# Altium project ISO_DP_MCP4651_Project.PrjPCB
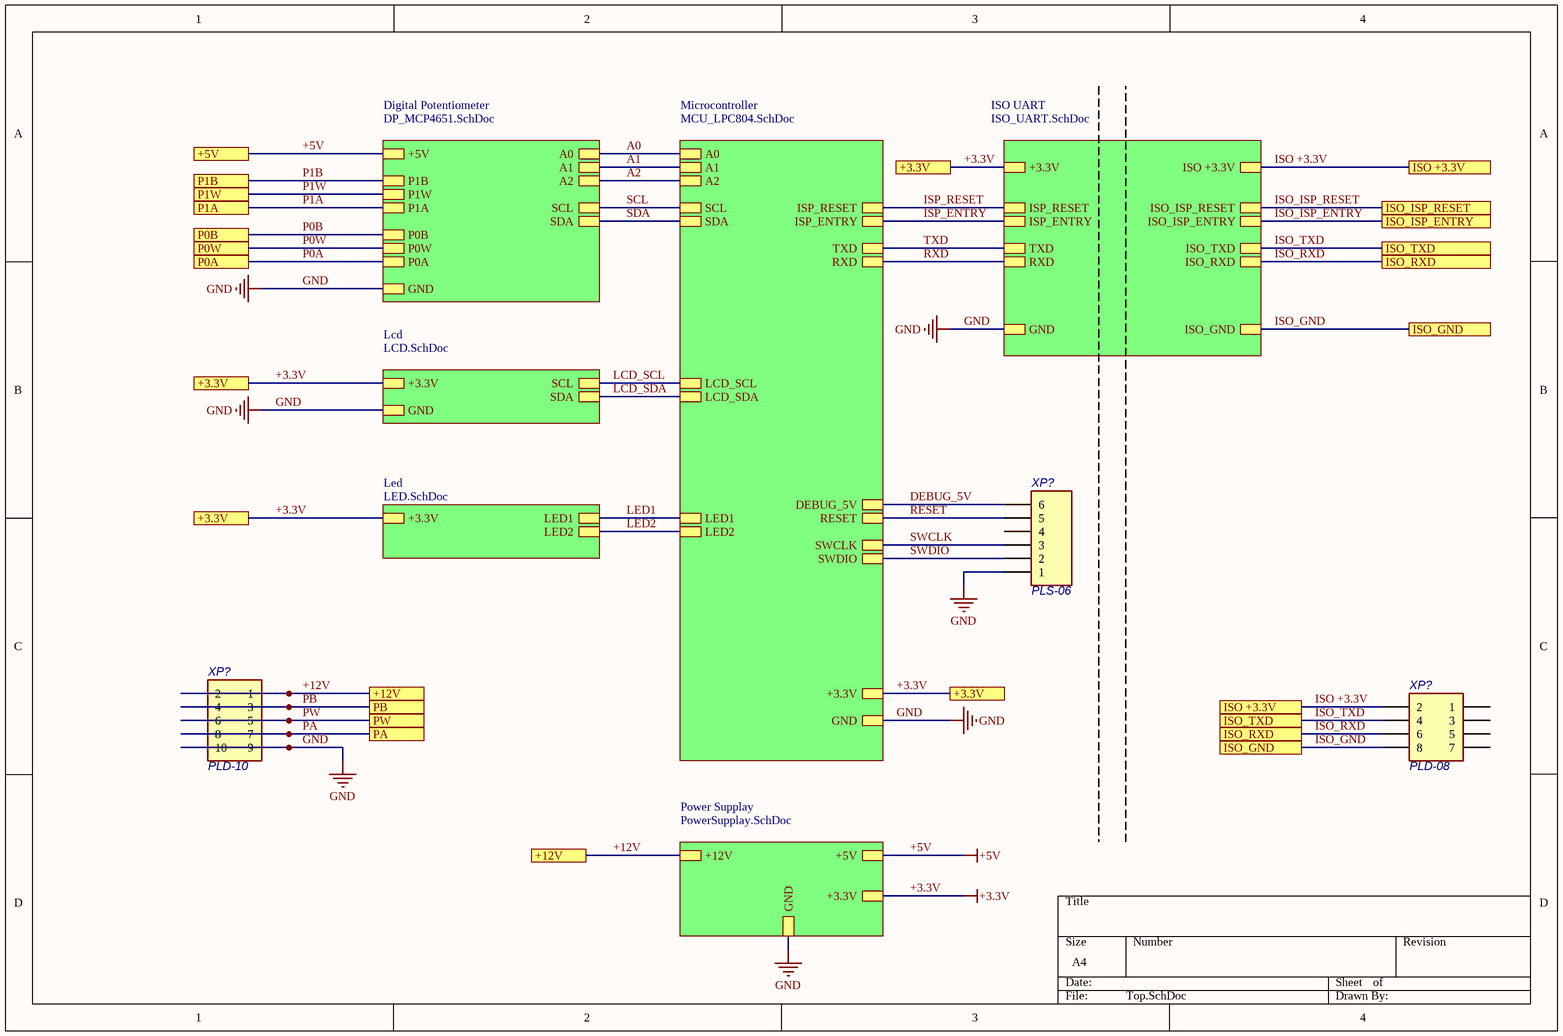
[diagram p0: Top.SchDoc]
7 sheets, 51 parts. Net scope: hierarchical (ports join the sheet entries above them; power ports are global).
Sheets:
  Top.SchDoc
    Digital Potentiometer = DP_MCP4651.SchDoc
    Microcontroller = MCU_LPC804.SchDoc
    Power Supplay = PowerSupplay.SchDoc
    ISO UART = ISO_UART.SchDoc
    Led = LED.SchDoc
    Lcd = LCD.SchDoc

## Sheet Top.SchDoc
size A4

### Parts
(Parts that share a designator on the sheet are numbered #1, #2 ... from top to bottom, then left to right.)
XP?#1  PLS-06  [PLS-06]
XP?#2  PLD-10  [PLD-10]
XP?#3  PLD-08  [PLD-08]

### Sub-sheets
Digital Potentiometer = DP_MCP4651.SchDoc: SCL, SDA, +5V, A0, A1, A2, P1B, P1W, P1A, P0B, P0A, P0W, GND
ISO UART = ISO_UART.SchDoc: ISP_RESET, ISP_ENTRY, ISO_ISP_RESET, ISO_ISP_ENTRY, +3.3V, ISO +3.3V, GND, ISO_GND, ISO_TXD, ISO_RXD, TXD, RXD
Lcd = LCD.SchDoc: GND, +3.3V, SCL, SDA
Led = LED.SchDoc: +3.3V, LED1, LED2
Microcontroller = MCU_LPC804.SchDoc: SCL, SDA, ISP_RESET, ISP_ENTRY, A0, A1, A2, LCD_SCL, LCD_SDA, DEBUG_5V, RESET, SWCLK, SWDIO, LED1, LED2, +3.3V, GND, TXD, RXD
Power Supplay = PowerSupplay.SchDoc: +3.3V, GND, +12V, +5V

### Ports
+3.3V, +5V, +12V, ISO +3.3V, ISO_GND, ISO_ISP_ENTRY, ISO_ISP_RESET, ISO_RXD, ISO_TXD, P0A, P0B, P0W, P1A, P1B, P1W, PA, PB, PW

### Nets
+3.3V: port +3.3V, sheet Microcontroller/+3.3V, sheet Power Supplay/+3.3V, sheet ISO UART/+3.3V, sheet Led/+3.3V, sheet Lcd/+3.3V
+5V: port +5V, sheet Digital Potentiometer/+5V, sheet Power Supplay/+5V
GND: XP?#1.1 XP?#2.9 XP?#2.10 ; sheet Digital Potentiometer/GND, sheet Microcontroller/GND, sheet Power Supplay/GND, sheet ISO UART/GND, sheet Lcd/GND
+12V: XP?#2.1 XP?#2.2 ; port +12V, sheet Power Supplay/+12V
A0: sheet Digital Potentiometer/A0, sheet Microcontroller/A0
A1: sheet Digital Potentiometer/A1, sheet Microcontroller/A1
A2: sheet Digital Potentiometer/A2, sheet Microcontroller/A2
DEBUG_5V: XP?#1.6 ; sheet Microcontroller/DEBUG_5V
ISO +3.3V: XP?#3.2 ; port ISO +3.3V, sheet ISO UART/ISO +3.3V
ISO_GND: XP?#3.8 ; port ISO_GND, sheet ISO UART/ISO_GND
ISO_ISP_ENTRY: port ISO_ISP_ENTRY, sheet ISO UART/ISO_ISP_ENTRY
ISO_ISP_RESET: port ISO_ISP_RESET, sheet ISO UART/ISO_ISP_RESET
ISO_RXD: XP?#3.6 ; port ISO_RXD, sheet ISO UART/ISO_RXD
ISO_TXD: XP?#3.4 ; port ISO_TXD, sheet ISO UART/ISO_TXD
ISP_ENTRY: sheet Microcontroller/ISP_ENTRY, sheet ISO UART/ISP_ENTRY
ISP_RESET: sheet Microcontroller/ISP_RESET, sheet ISO UART/ISP_RESET
LCD_SCL: sheet Microcontroller/LCD_SCL, sheet Lcd/SCL
LCD_SDA: sheet Microcontroller/LCD_SDA, sheet Lcd/SDA
LED1: sheet Microcontroller/LED1, sheet Led/LED1
LED2: sheet Microcontroller/LED2, sheet Led/LED2
P0A: port P0A, sheet Digital Potentiometer/P0A
P0B: port P0B, sheet Digital Potentiometer/P0B
P0W: port P0W, sheet Digital Potentiometer/P0W
P1A: port P1A, sheet Digital Potentiometer/P1A
P1B: port P1B, sheet Digital Potentiometer/P1B
P1W: port P1W, sheet Digital Potentiometer/P1W
PA: XP?#2.7 XP?#2.8 ; port PA
PB: XP?#2.3 XP?#2.4 ; port PB
PW: XP?#2.5 XP?#2.6 ; port PW
RESET: XP?#1.5 ; sheet Microcontroller/RESET
RXD: sheet Microcontroller/RXD, sheet ISO UART/RXD
SCL: sheet Digital Potentiometer/SCL, sheet Microcontroller/SCL
SDA: sheet Digital Potentiometer/SDA, sheet Microcontroller/SDA
SWCLK: XP?#1.3 ; sheet Microcontroller/SWCLK
SWDIO: XP?#1.2 ; sheet Microcontroller/SWDIO
TXD: sheet Microcontroller/TXD, sheet ISO UART/TXD

Not connected (* = marked no-connect by the designer): XP?#1 4; XP?#3 1 3 5 7

### Library data of the parts
XP?#1 = PLS-06: Однорядный прямой штыревой соединитель; Manufacturer: BrownBear; SpecificationName: Connector; Ведомость покупных: Y; Author: Gr.; Part Number: PLS-06; DateModification: 24.03.2011; ManufacturerPartNumber: PLS-06; Value: *; Tolerance: *; Power\Voltage: *; TKE: *; Корпус: *; TU/GOST: *; Примечание: *; Rem: *; ComponentLink1Description: Parametrs; ComponentLink2Description: Site; ComponentLink2URL: http://www.brownbear.ru/; Component Type: Standard; Component Kind: Standard
XP?#2 = PLD-10: Двухрядный прямой штыревой соединитель; Manufacturer: BrownBear; SpecificationName: Connector; Ведомость покупных: Y; Author: Gr.; Part Number: PLD-10; DateModification: 24.03.2011; ManufacturerPartNumber: PLD-10; Value: *; Tolerance: *; Power\Voltage: *; TKE: *; Корпус: *; TU/GOST: *; Примечание: *; Rem: *; ComponentLink1Description: Parametrs; ComponentLink2Description: Site; ComponentLink2URL: http://www.brownbear.ru/; Component Type: Standard; Component Kind: Standard
XP?#3 = PLD-08: Двухрядный прямой штыревой соединитель; Manufacturer: BrownBear; SpecificationName: Connector; Ведомость покупных: Y; Author: Gr.; Part Number: PLD-08; DateModification: 24.03.2011; ManufacturerPartNumber: PLD-08; Value: *; Tolerance: *; Power\Voltage: *; TKE: *; Корпус: *; TU/GOST: *; Примечание: *; Rem: *; ComponentLink1Description: Parametrs; ComponentLink2Description: Site; ComponentLink2URL: http://www.brownbear.ru/; Component Type: Standard; Component Kind: Standard

## Sheet DP_MCP4651.SchDoc
size A4
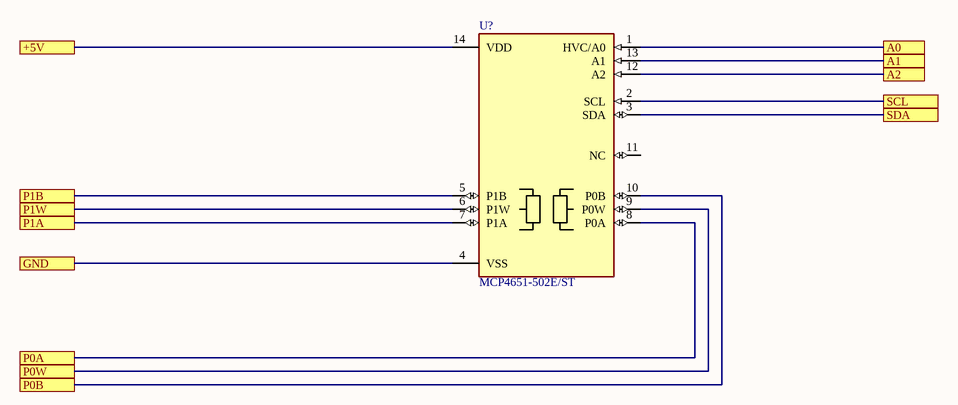
[diagram p1: DP_MCP4651.SchDoc]

### Parts
(Parts that share a designator on the sheet are numbered #1, #2 ... from top to bottom, then left to right.)
U?#1  MCP4651-502E/ST  [TSSOP-14]

### Ports
+5V, A0, A1, A2, GND, P0A, P0B, P0W, P1A, P1B, P1W, SCL, SDA

### Nets
+5V: U?#1.14(VDD) ; port +5V
GND: U?#1.4(VSS) ; port GND
A0: U?#1.1(HVC/A0) ; port A0
A1: U?#1.13(A1) ; port A1
A2: U?#1.12(A2) ; port A2
P0A: U?#1.8(P0A) ; port P0A
P0B: U?#1.10(P0B) ; port P0B
P0W: U?#1.9(P0W) ; port P0W
P1A: U?#1.7(P1A) ; port P1A
P1B: U?#1.5(P1B) ; port P1B
P1W: U?#1.6(P1W) ; port P1W
SCL: U?#1.2(SCL) ; port SCL
SDA: U?#1.3(SDA) ; port SDA

Not connected (* = marked no-connect by the designer): U?#1 11(NC)

### Library data of the parts
U?#1 = MCP4651: Digital Potentiometr; Manufacturer: Microchip; SpecificationName: IC; Package: None; Price: None; Value: *; MP: MCP4651-502E/ST; Availability: Unavailable; Part Number: MCP4651; Author: Sun; DateModification: 14.02.2022; ManufacturerPartNumber: MCP4651; Корпус: TSSOP-14

## Sheet MCU_LPC804.SchDoc
size A4
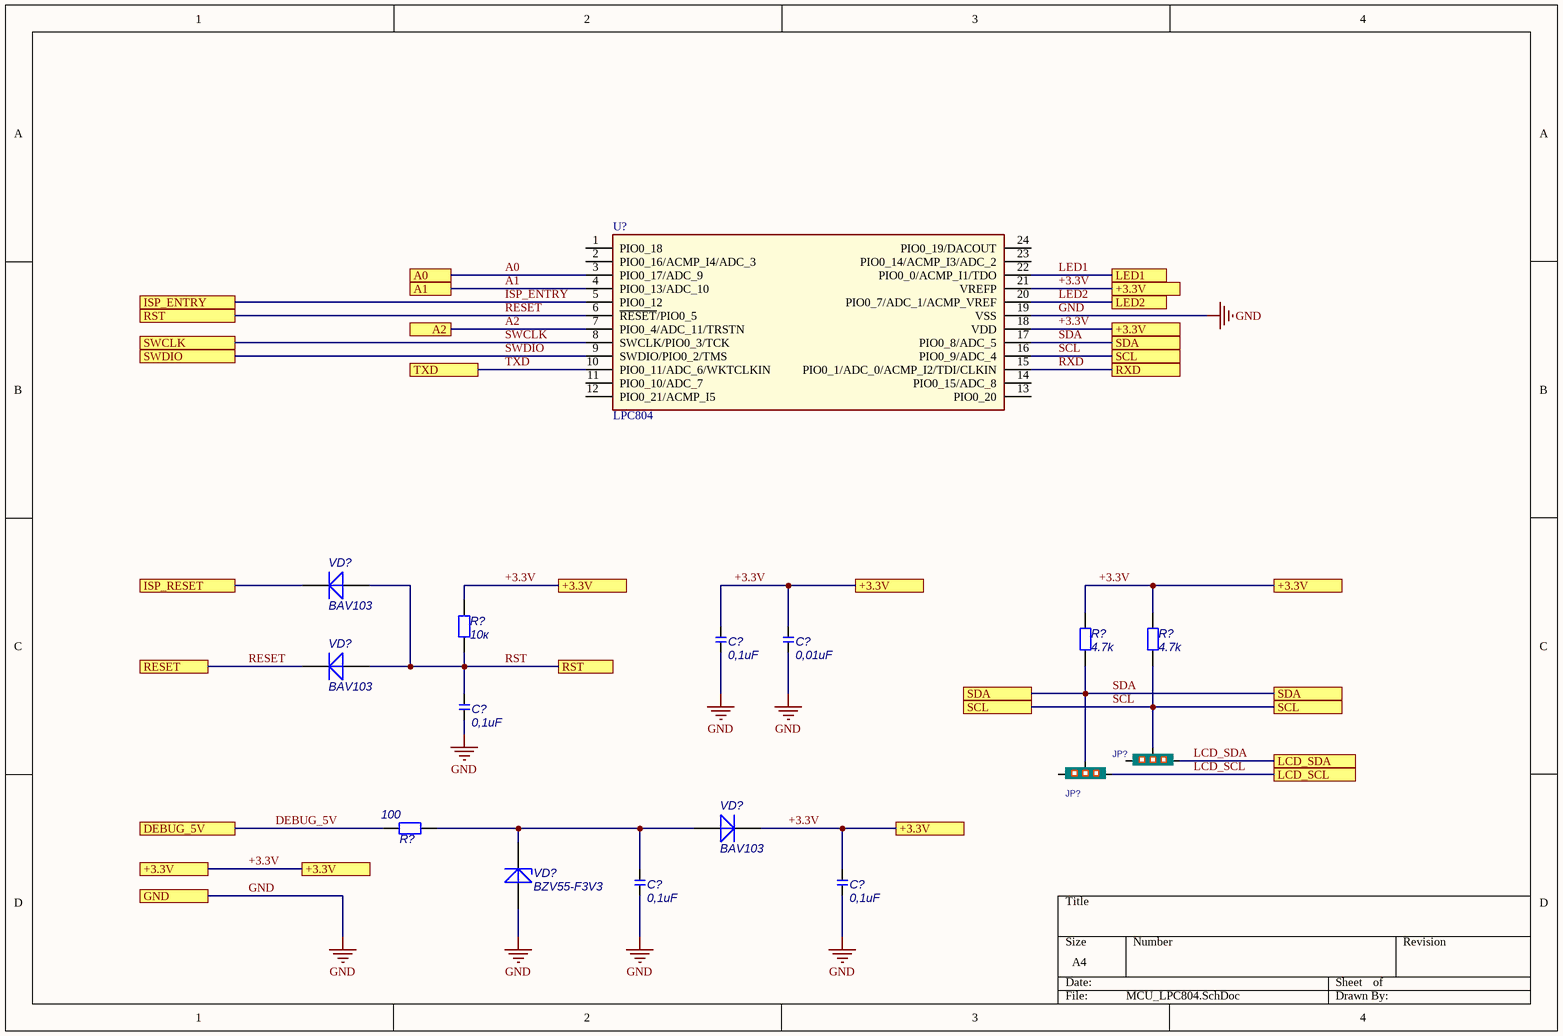
[diagram p2: MCU_LPC804.SchDoc]

### Parts
(Parts that share a designator on the sheet are numbered #1, #2 ... from top to bottom, then left to right.)
C?#1  0,1uF  [SMD1206-v1]
C?#2  0,01uF  [SMD1206-v1]
C?#3  0,1uF  [SMD1206-v1]
C?#4  0,1uF  [SMD1206-v1]
C?#5  0,1uF  [SMD1206-v1]
JP?#1  JP3_1  [Jumper_3]  (value not drawn)
JP?#2  JP3_1  [Jumper_3]  (value not drawn)
R?#1  4.7k  [SMD1206-v1]
R?#2  4.7k  [SMD1206-v1]
R?#3  10к  [SMD1206-v1]
R?#4  100  [SMD1206-v1]
U?#2  LPC804  [TSSOP-24_1]
VD?#1  BAV103  [SOD80C_V1]
VD?#2  BAV103  [SOD80C_V1]
VD?#3  BAV103  [SOD80C_V1]
VD?#4  BZV55-F3V3  [SOD80C_V1]

### Ports
+3.3V, A0, A1, A2, DEBUG_5V, GND, ISP_ENTRY, ISP_RESET, LCD_SCL, LCD_SDA, LED1, LED2, RESET, RST, RXD, SCL, SDA, SWCLK, SWDIO, TXD

### Nets
+3.3V: C?#1.2 C?#2.2 C?#5.2 R?#1.2 R?#2.2 R?#3.1 U?#2.18(VDD) U?#2.21(VREFP) VD?#3.2(K) ; port +3.3V
GND: C?#1.1 C?#2.1 C?#3.1 C?#4.1 C?#5.1 U?#2.19(VSS) VD?#4.1(A) ; port GND
A0: U?#2.3(PIO0_17/ADC_9) ; port A0
A1: U?#2.4(PIO0_13/ADC_10) ; port A1
A2: U?#2.7(PIO0_4/ADC_11/TRSTN) ; port A2
DEBUG_5V: R?#4.2 ; port DEBUG_5V
ISP_ENTRY: U?#2.5(PIO0_12) ; port ISP_ENTRY
ISP_RESET: VD?#1.2(K) ; port ISP_RESET
LCD_SCL: JP?#2.1 ; port LCD_SCL
LCD_SDA: JP?#1.1 ; port LCD_SDA
LED1: U?#2.22(PIO0_0/ACMP_I1/TDO) ; port LED1
LED2: U?#2.20(PIO0_7/ADC_1/ACMP_VREF) ; port LED2
RESET: C?#3.2 R?#3.2 U?#2.6(~{RESET}/PIO0_5) VD?#1.1(A) VD?#2.1(A) VD?#2.2(K) ; port RST, port RESET  [also labelled RST]
RXD: U?#2.15(PIO0_1/ADC_0/ACMP_I2/TDI/CLKIN) ; port RXD
SCL: JP?#1.2 R?#2.1 U?#2.16(PIO0_9/ADC_4) ; port SCL
SDA: JP?#2.2 R?#1.1 U?#2.17(PIO0_8/ADC_5) ; port SDA
SWCLK: U?#2.8(SWCLK/PIO0_3/TCK) ; port SWCLK
SWDIO: U?#2.9(SWDIO/PIO0_2/TMS) ; port SWDIO
TXD: U?#2.10(PIO0_11/ADC_6/WKTCLKIN) ; port TXD
NetC?#4_2: C?#4.2 R?#4.1 VD?#3.1(A) VD?#4.2(K)

Not connected (* = marked no-connect by the designer): JP?#1 3; JP?#2 3; U?#2 1(PIO0_18) 2(PIO0_16/ACMP_I4/ADC_3) 11(PIO0_10/ADC_7) 12(PIO0_21/ACMP_I5) 13(PIO0_20) 14(PIO0_15/ADC_8) 23(PIO0_14/ACMP_I3/ADC_2) 24(PIO0_19/DACOUT)

### Library data of the parts
C?#1 C?#3-C?#5 = SMD1206-0.1uF-50V: Конденсатор неполярный; Manufacturer: AVX; Power\Voltage: 50V; Ведомость покупных: Y; Author: Sun; Part Number: SMD1206-0.1uF-50V; DateModification: 11.10.2016; ManufacturerPartNumber: *; Value: 0,1uF; Tolerance: *; TKE: *; Корпус: SMD1206; TU/GOST: *; Примечание: *; Rem: *; SpecificationName: Конденсатор; ComponentLink1Description: Параметры; ComponentLink1URL: *; ComponentLink2Description: Сайт производителя; ComponentLink2URL: http://www.avx.com/; Component Type: Standard; Component Kind: Standard
C?#2 = SMD1206-0.01uF-50V: Конденсатор неполярный; Manufacturer: AVX; Power\Voltage: 50V; Ведомость покупных: Y; Author: Sun; Part Number: SMD1206-0.01uF-50V; DateModification: 11.10.2016; ManufacturerPartNumber: *; Value: 0,01uF; Tolerance: *; TKE: *; Корпус: SMD1206; TU/GOST: *; Примечание: *; Rem: *; SpecificationName: Конденсатор; ComponentLink1Description: Параметры; ComponentLink1URL: *; ComponentLink2Description: Сайт производителя; ComponentLink2URL: http://www.avx.com/; Component Type: Standard; Component Kind: Standard
JP?#1 JP?#2 = Jumper_3_a_pin: Part Field 1: 17-Jul-2002; Part Field 2: Re-released for DXP Platform.; Part Field 3: Altium Limited; Part Number: Jumper_3_a_pin
R?#1 R?#2 = SMD1206-4.7k-1%: Резистор постоянный; Manufacturer: Rohm Semiconductor; Tolerance: 1%; Ведомость покупных: Y; Author: Sun; Part Number: SMD1206-4.7k-1%; DateModication: 12.10.2016; ManufacturerPartNumber: *; Value: 4.7k; Power\Voltage: *; TKE: *; Корпус: SMD1206; TU/GOST: *; Примечание: *; Rem: *; SpecificationName: Резистор; ComponentLink1Description: Параметры; ComponentLink1URL: *; ComponentLink2Description: Сайт производителя; ComponentLink2URL: http://www.royalohm.com/; Component Type: Standard; Component Kind: Standard
R?#3 = SMD1206-10k-1%: Резистор постоянный; Manufacturer: Rohm Semiconductor; Tolerance: 1%; Ведомость покупных: Y; Author: Sun; Part Number: SMD1206-10k-1%; DateModication: 12.10.2016; ManufacturerPartNumber: *; Value: 10к; Power\Voltage: *; TKE: *; Корпус: SMD1206; TU/GOST: *; Примечание: *; Rem: *; SpecificationName: Резистор; ComponentLink1Description: Параметры; ComponentLink1URL: *; ComponentLink2Description: Сайт производителя; ComponentLink2URL: http://www.royalohm.com/; Component Type: Standard; Component Kind: Standard
R?#4 = SMD1206-100-1%: Резистор постоянный; Manufacturer: Rohm Semiconductor; Tolerance: 1%; Ведомость покупных: Y; Author: Sun; Part Number: SMD1206-100-1%; DateModication: 12.10.2016; ManufacturerPartNumber: *; Value: 100; Power\Voltage: *; TKE: *; Корпус: SMD1206; TU/GOST: *; Примечание: *; Rem: *; SpecificationName: Резистор; ComponentLink1Description: Параметры; ComponentLink1URL: *; ComponentLink2Description: Сайт производителя; ComponentLink2URL: http://www.royalohm.com/; Component Type: Standard; Component Kind: Standard
U?#2 = LPC804-TSSOP24: Microcontroller; Manufacturer: NXP; SpecificationName: IC; Bills of materials: Y; Part Number: LPC804-TSSOP24; Author: Sun; DateModification: 21.12.2020; ManufacturerPartNumber: LPC804; Value: *; Tolerance: *; Power\Voltage: *; TKE: *; Package: TSSOP-24; TU/GOST: *; Note: *; Rem: *; ComponentLink1Description: Site; ComponentLink1URL: http://www.nxp.com/; ComponentLink2Description: Parameters; Component Type: Standart; Component Kind: Standart
VD?#1-VD?#3 = BAV103: Диод; Manufacturer: NXP; Корпус: SOD80C; SpecificationName: Diod; Ведомость покупных: Y; Author: Gr.; Part Number: BAV103; DateModification: 23.02.2011; ManufacturerPartNumber: BAV103; Value: *; Tolerance: *; Power\Voltage: *; TKE: *; TU/GOST: *; Примечание: *; Rem: *; ComponentLink1Description: Parametrs; ComponentLink2Description: Сайт производителя; ComponentLink2URL: http://www.nxp.com/; Component Type: Standard; Component Kind: Standard
VD?#4 = BZV55-F3V3: Стабилитрон; Manufacturer: NXP; Tolerance: 3%; Корпус: SOD80C; Ведомость покупных: Y; Author: Gr.; Part Number: BZV55-F3V3; DateModification: 28.02.2011; ManufacturerPartNumber: BZV55-F3V3; Value: *; Power\Voltage: *; TKE: *; TU/GOST: *; Примечание: *; Rem: *; SpecificationName: Стабилитрон; ComponentLink1Description: Parametrs; ComponentLink2Description: Сайт производителя; ComponentLink2URL: http://www.nxp.com/; Component Type: Standard; Component Kind: Standard

## Sheet PowerSupplay.SchDoc
size A4
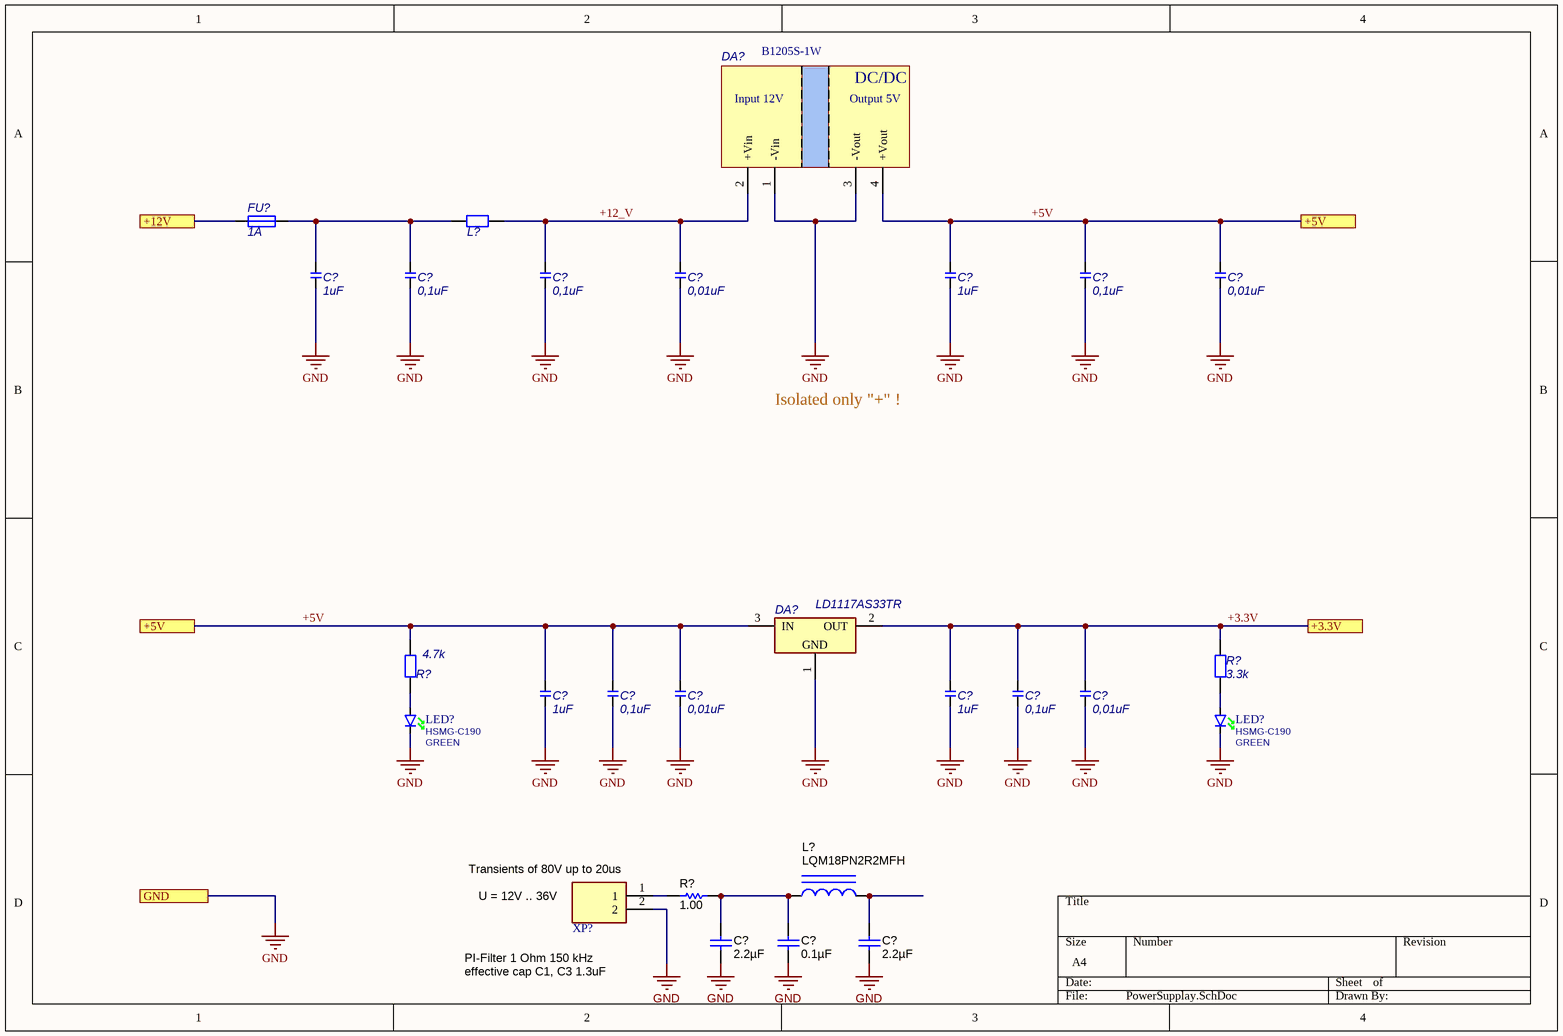
[diagram p3: PowerSupplay.SchDoc]

### Parts
(Parts that share a designator on the sheet are numbered #1, #2 ... from top to bottom, then left to right.)
C?#6  1uF  [SMD1206-v1]
C?#7  0,1uF  [SMD1206-v1]
C?#8  0,1uF  [SMD1206-v1]
C?#9  0,01uF  [SMD1206-v1]
C?#10  1uF  [SMD1206-v1]
C?#11  0,1uF  [SMD1206-v1]
C?#12  0,01uF  [SMD1206-v1]
C?#13  1uF  [SMD1206-v1]
C?#14  0,1uF  [SMD1206-v1]
C?#15  0,01uF  [SMD1206-v1]
C?#16  1uF  [SMD1206-v1]
C?#17  0,1uF  [SMD1206-v1]
C?#18  0,01uF  [SMD1206-v1]
C?#19  ValueDisplayed: 2.2µF  [1206_033]  (hidden comment: UMK316B7225KD-T)
C?#20  ValueDisplayed: 0.1µF  [0603]  (hidden comment: C1608X7R1H104K)
C?#21  ValueDisplayed: 2.2µF  [1206_033]  (hidden comment: UMK316B7225KD-T)
DA?#1  (no value)  [B1205S-1W]
DA?#2  LD1117AS33TR  [SOT-223_1]
FU?  1A  [SMD1206-v1]
L?#1  0  [SMD1206-v1]  (value not drawn)
L?#2  LQM18PN2R2MFH  [0603]
LED?#1  Manufacturer Part No.: HSMG-C190  Color: GREEN  [LEDC1608X80N_G]  (hidden comment: LED)
LED?#2  Manufacturer Part No.: HSMG-C190  Color: GREEN  [LEDC1608X80N_G]  (hidden comment: LED)
R?#5  4.7k  [SMD1206-v1]
R?#6  3.3k  [SMD1206-v1]
R?#7  ValueDisplayed: 1.00  [0603]  (hidden comment: CRCW06031R00FKEA)
XP?#4  TB006-508-02BE  [CUI_TB006-508-02BE]  (value not drawn)

### Ports
+3.3V, +5V, +12V, GND

### Nets
+3.3V: C?#16.2 C?#17.2 C?#18.2 DA?#2.2(OUT) R?#6.2 ; port +3.3V
+5V: C?#10.2 C?#11.2 C?#12.2 C?#13.2 C?#14.2 C?#15.2 DA?#1.4(+Vout) DA?#2.3(IN) R?#5.2 ; port +5V
GND: C?#6.1 C?#7.1 C?#8.1 C?#9.1 C?#10.1 C?#11.1 C?#12.1 C?#13.1 C?#14.1 C?#15.1 C?#16.1 C?#17.1 C?#18.1 C?#19.2 C?#20.2 C?#21.2 DA?#1.1(-Vin) DA?#1.3(-Vout) DA?#2.1(GND) LED?#1.1(K) LED?#2.1(K) XP?#4.2 ; port GND
+12_V: C?#8.2 C?#9.2 DA?#1.2(+Vin) L?#1.1
+12V: FU?.1 ; port +12V
NetC?#6_2: C?#6.2 C?#7.2 FU?.2 L?#1.2
NetC?#19_1: C?#19.1 C?#20.1 L?#2.1 R?#7.1
NetC?#21_1: C?#21.1 L?#2.2
NetLED?#1_2: LED?#1.2(A) R?#5.1
NetLED?#2_2: LED?#2.2(A) R?#6.1
NetR?#7_2: R?#7.2 XP?#4.1

### Notes on the sheet
- Isolated only "+" !
- U = 12V .. 36V
- (near XP?#4) Transients of 80V up to 20us
- (near XP?#4) PI-Filter 1 Ohm 150 kHz
  effective cap C1, C3 1.3uF
- (in symbol B1205S-1W) DC/DC; Input 12V; Output 5V

### Library data of the parts
C?#6 C?#10 C?#13 C?#16 = SMD1206-1uF-50V: Конденсатор неполярный; Manufacturer: AVX; Power\Voltage: 50V; Ведомость покупных: Y; Author: Sun; Part Number: SMD1206-1uF-50V; DateModification: 11.10.2016; ManufacturerPartNumber: *; Value: 1uF; Tolerance: *; TKE: *; Корпус: SMD1206; TU/GOST: *; Примечание: *; Rem: *; SpecificationName: Конденсатор; ComponentLink1Description: Параметры; ComponentLink1URL: *; ComponentLink2Description: Сайт производителя; ComponentLink2URL: http://www.avx.com/; Component Type: Standard; Component Kind: Standard
C?#7 C?#8 C?#11 C?#14 C?#17 = SMD1206-0.1uF-50V: as C?#1 on sheet MCU_LPC804; Author: Sun; Part Number: SMD1206-0.1uF-50V; DateModification: 11.10.2016; ManufacturerPartNumber: *; Value: 0,1uF; Tolerance: *; TKE: *; Корпус: SMD1206; TU/GOST: *; Примечание: *; Rem: *; SpecificationName: Конденсатор; ComponentLink1Description: Параметры; ComponentLink1URL: *; ComponentLink2Description: Сайт производителя; ComponentLink2URL: http://www.avx.com/; Component Type: Standard; Component Kind: Standard
C?#9 C?#12 C?#15 C?#18 = SMD1206-0.01uF-50V: as C?#2 on sheet MCU_LPC804; Author: Sun; Part Number: SMD1206-0.01uF-50V; DateModification: 11.10.2016; ManufacturerPartNumber: *; Value: 0,01uF; Tolerance: *; TKE: *; Корпус: SMD1206; TU/GOST: *; Примечание: *; Rem: *; SpecificationName: Конденсатор; ComponentLink1Description: Параметры; ComponentLink1URL: *; ComponentLink2Description: Сайт производителя; ComponentLink2URL: http://www.avx.com/; Component Type: Standard; Component Kind: Standard
C?#19 C?#21 = UMK316B7225KD-T: CAP, CERM, 2.2 µF, 50 V, +/- 10%, X7R, 1206; Manufacturer: Taiyo Yuden; Polarized: N; CompType: Capacitor; Value: 2.2uF; U/M: EA; Cap_F: 0.0000022; Tolerance_%: 10; Value1: Unknown; VDC_V: 50; Value2: 50V; TaMin_C: -55; TaMax_C: 125; Cap_Case: 1206; SymbolVersion: 2008-07-09; PartNumber: UMK316B7225KD-T; PackageReference: 1206; RoHS: Y; MountType: SMT; Technology: Ceramic; TempCo: X7R; Published: 2008-06-19; Publisher: Texas Instruments; LatestRevisionDate: 2014-11-14; ComponentLink1Description: Datasheet link; ComponentLink1URL: http://www.yuden.co.jp/or/product/category/capacitor/UMK316B7225KL-T.pdf; Supplier 1: Digi-Key; Supplier Part Number 1: 587-3168-1-ND
C?#20 = C1608X7R1H104K: CAP, CERM, 0.1 µF, 50 V, +/- 10%, X7R, 0603; Manufacturer: TDK; Polarized: N; CompType: Capacitor; Value: 0.1uF; U/M: EA; Cap_F: 0.0000001; Tolerance_%: 10; ESR_ohm: 0.017; Value1: 0.017 ohm; VDC_V: 50; Value2: 50V; TaMin_C: -55; TaMax_C: 125; SymbolVersion: 2008-07-09; PartNumber: C1608X7R1H104K; PackageReference: 0603; RoHS: Y; MountType: SMT; Technology: Ceramic; TempCo: X7R; Cap_Case: 0603; Published: 2008-06-19; Publisher: Texas Instruments; LatestRevisionDate: 2014-11-24; ComponentLink1Description: Datasheet link; ComponentLink1URL: http://www.tdk.co.jp/tefe02/e412_c.pdf; Supplier 1: Digi-Key; Supplier Part Number 1: 445-1314-1-ND; Supplier 2: Farnell; Supplier Part Number 2: 1118182
DA?#1 = B1205S-1W: Input +12V, Output +5V, P=1W, Isolation; Корпус: SIP-4; SpecificationName: ISO Power Module; ComponentLink1Description: *; ComponentLink1URL: *; ComponentLink2Description: *; ComponentLink2URL: *; Manufacturer: *; Power\Voltage: *; Rem: *; TKE: *; Tolerance: *; TU/GOST: *; Примечание: *; Author: Sun; DateModification: 14.02.2022; Value: *; Part Number: B1205S-1W
DA?#2 = LD1117AS33TR: Low Drop 3,3V; Manufacturer: STM; Корпус: SOT-223; SpecificationName: Регулятор напряжения; ComponentLink1Description: Параметры; ComponentLink1URL: *; ComponentLink2Description: Сайт производителя; ComponentLink2URL: *; Power\Voltage: *; Rem: *; TKE: *; Tolerance: *; TU/GOST: *; Примечание: *; Author: Gr.; DateModification: 14.03.2011; Value: *; ManufacturerPartNumber: LD1117AS33TR; Part Number: LD1117AS33TR
FU? = Fuse_1A: SpecificationName: Предохранитель; ComponentLink1Description: Параметры; ComponentLink1URL: *; ComponentLink2Description: Сайт производителя; ComponentLink2URL: *; Manufacturer: *; Power\Voltage: *; Rem: *; TKE: *; Tolerance: *; TU/GOST: *; Корпус: *; Примечание: *; Author: Sun; DateModification: 16.02.2022; ManufacturerPartNumber: *; Value: 1A; Part Number: Fuse_1A; Package: 1206
L?#1 = SMD1206-0: Резистор постоянный; Manufacturer: Rohm Semiconductor; Ведомость покупных: Y; Author: Sun; Part Number: SMD1206-0; DateModication: 12.10.2016; ManufacturerPartNumber: *; Value: 0; Tolerance: *; Power\Voltage: *; TKE: *; Корпус: SMD1206; TU/GOST: *; Примечание: *; Rem: *; SpecificationName: Резистор; ComponentLink1Description: Параметры; ComponentLink1URL: *; ComponentLink2Description: Сайт производителя; ComponentLink2URL: http://www.royalohm.com/; Component Type: Standard; Component Kind: Standard
L?#2 = LQM18PN2R2MFH: Inductor, Ferrite, 2.2 µH, 0.35 A, 0.38 ohm, SMD; Manufacturer: MuRata; Value: 2.2uH; Imax_A: 0.35; DCR_ohm: 0.38; Value2: 0.35A; Ind_H: 2.2E-6; ValueDisplayed: 2.2µH; Irms: 0.9A @ 40C rise; Isat: 0.35A @ 30% inductance drop; CompType: Inductor; SymbolVersion: 2008-07-23; PartNumber: LQM18PN2R2MFH; Value1: 0.38 ohm; MountType: SMT; PackageReference: 0603; Published: 2008-06-26; Publisher: Texas Instruments; LatestRevisionDate: 2014-11-24; ComponentLink1Description: Datasheet link; ComponentLink1URL: https://sps06.itg.ti.com/sites/KMS/crossdivteams/altium/docs/ComponentDatasheets/Murata Power Inductor Product Update_2013 July.pdf; RoHS: Y; Supplier 1: Digi-Key; Supplier Part Number 1: 490-9571-1-ND; Material: Ferrite
LED?#1 LED?#2 = LED-Avago-HSMG-C190_Green: Surface mount LED green 20mA; Manufacturer Name: Avago; Part Number: LED-Avago-HSMG-C190_Green; ManufacturerPartNumber: LED-Avago-HSMG-C190_Green
R?#5 = SMD1206-4.7k-1%: as R?#1 on sheet MCU_LPC804; Author: Sun; Part Number: SMD1206-4.7k-1%; DateModication: 12.10.2016; ManufacturerPartNumber: *; Value: 4.7k; Power\Voltage: *; TKE: *; Корпус: SMD1206; TU/GOST: *; Примечание: *; Rem: *; SpecificationName: Резистор; ComponentLink1Description: Параметры; ComponentLink1URL: *; ComponentLink2Description: Сайт производителя; ComponentLink2URL: http://www.royalohm.com/; Component Type: Standard; Component Kind: Standard
R?#6 = SMD1206-3.3k-1%: Резистор постоянный; Manufacturer: Rohm Semiconductor; Tolerance: 1%; Ведомость покупных: Y; Author: Sun; Part Number: SMD1206-3.3k-1%; DateModication: 12.10.2016; ManufacturerPartNumber: *; Value: 3.3k; Power\Voltage: *; TKE: *; Корпус: SMD1206; TU/GOST: *; Примечание: *; Rem: *; SpecificationName: Резистор; ComponentLink1Description: Параметры; ComponentLink1URL: *; ComponentLink2Description: Сайт производителя; ComponentLink2URL: http://www.royalohm.com/; Component Type: Standard; Component Kind: Standard
R?#7 = CRCW06031R00FKEA: RES, 1.00, 1%, 0.1 W, 0603; Manufacturer: Vishay-Dale; CompType: Resistor; Value: 1.00; Res_ohm: 1; Value_Code: 1R00; Power_W: 0.1; Value2: 0.1W; VDC_V: 75; TempCo: 100 ppm/C; EIA_Code: E96; U/M: EA; SymbolVersion: 2009-05-29; PartNumber: CRCW06031R00FKEA; PackageReference: 0603; RoHS: Y; Tolerance_%: 1; Value1: 1%; MountType: SMT; Technology: Thick Film; Published: 2008-06-26; Publisher: Texas Instruments; LatestRevisionDate: 2014-10-21; ComponentLink1Description: Datasheet link; ComponentLink1URL: http://www.vishay.com/docs/20035/dcrcwe3.pdf; Supplier 1: Digi-Key; Supplier Part Number 1: 541-1.00HHCT-ND; Supplier 2: Farnell; Supplier Part Number 2: 1616871; Supplier 3: Newark; Supplier Part Number 3: 52K8059
XP?#4 = TB006-508-02BE: MF: CUI Devices; SpecificationName: Connector; Value: *; MP: TB006-508-02BE; SnapEDA_Link: https://www.snapeda.com/parts/TB006-508-02BE/CUI%20Devices/view-part/3591097/?ref=snap; Availability: Unavailable; Package: None; Price: None; CUI_purchase_URL: https://www.cuidevices.com/product/interconnect/connectors/terminal-blocks/tb006-508-series?utm_source=snapeda.com&utm_medium=referral&utm_campaign=snapedaBOM; Part Number: TB006-508-02BE; DateModification: 08.10.2021; ManufacturerPartNumber: TB006-508-02BE; Tolerance: *; Power\Voltage: *; TKE: *; Корпус: *; TU/GOST: *; Примечание: *; Rem: *; ComponentLink1Description: Parametrs

## Sheet ISO_UART.SchDoc
size A4
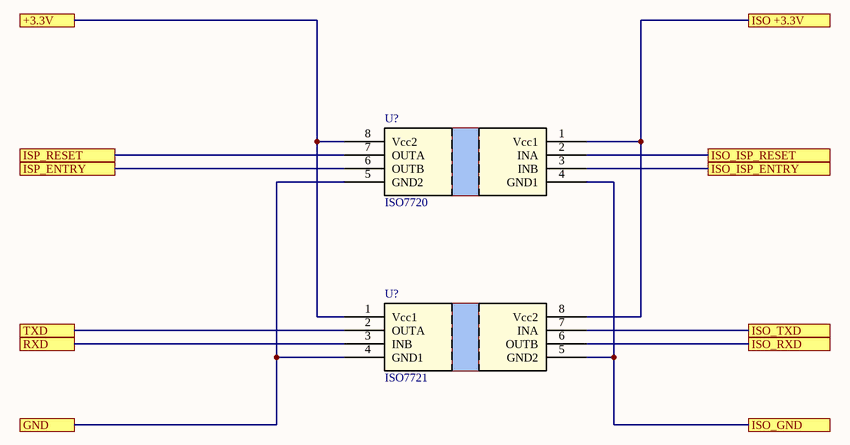
[diagram p4: ISO_UART.SchDoc]

### Parts
(Parts that share a designator on the sheet are numbered #1, #2 ... from top to bottom, then left to right.)
U?#3  ISO7720  [SOIC-8]
U?#4  ISO7721  [SOIC-8]

### Ports
+3.3V, GND, ISO +3.3V, ISO_GND, ISO_ISP_ENTRY, ISO_ISP_RESET, ISO_RXD, ISO_TXD, ISP_ENTRY, ISP_RESET, RXD, TXD

### Nets
+3.3V: U?#3.8(Vcc2) U?#4.1(Vcc1) ; port +3.3V
GND: U?#3.5(GND2) U?#4.4(GND1) ; port GND
ISO +3.3V: U?#3.1(Vcc1) U?#4.8(Vcc2) ; port ISO +3.3V
ISO_GND: U?#3.4(GND1) U?#4.5(GND2) ; port ISO_GND
ISO_ISP_ENTRY: U?#3.3(INB) ; port ISO_ISP_ENTRY
ISO_ISP_RESET: U?#3.2(INA) ; port ISO_ISP_RESET
ISO_RXD: U?#4.6(OUTB) ; port ISO_RXD
ISO_TXD: U?#4.7(INA) ; port ISO_TXD
ISP_ENTRY: U?#3.6(OUTB) ; port ISP_ENTRY
ISP_RESET: U?#3.7(OUTA) ; port ISP_RESET
RXD: U?#4.3(INB) ; port RXD
TXD: U?#4.2(OUTA) ; port TXD

### Library data of the parts
U?#3 = ISO7720-Q1: Dual channel digital isolator. High data rate up to 100 Mbps; Mfr_Name: Microchip; Manufacturer_Part_Number: MCP41010T-E/SN; Manufacturer: TI; Copyright: Copyright (C) 2021 Ultra Librarian. All rights reserved.; RefDes: RefDes; Type: DEV; Part Number: ISO7720-Q1; Author: Sun; DateModification: 15.02.2022; ManufacturerPartNumber: ISO7720; Package: SOIC-8
U?#4 = ISO7721-Q1: Dual channel digital isolator. High data rate up to 100 Mbps; Mfr_Name: Microchip; Manufacturer_Part_Number: MCP41010T-E/SN; Manufacturer: TI; ManufacturerPartNumber: ISO7720; Copyright: Copyright (C) 2021 Ultra Librarian. All rights reserved.; RefDes: RefDes; Type: DEV; Part Number: ISO7721-Q1; Author: Sun; DateModification: 15.02.2022; Package: SOIC-8

## Sheet LED.SchDoc
size A4
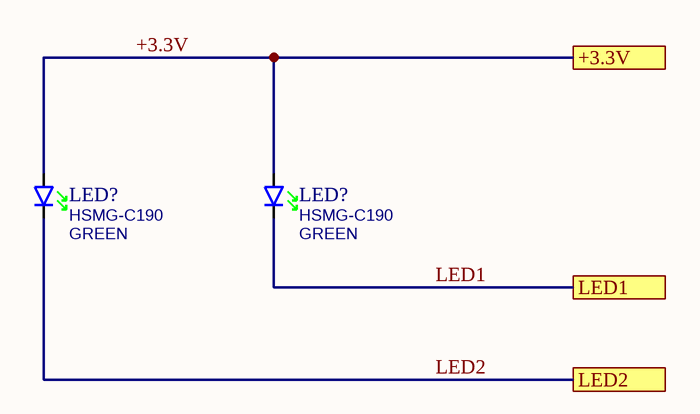
[diagram p5: LED.SchDoc]

### Parts
(Parts that share a designator on the sheet are numbered #1, #2 ... from top to bottom, then left to right.)
LED?#3  Manufacturer Part No.: HSMG-C190  Color: GREEN  [LEDC1608X80N_G]  (hidden comment: LED)
LED?#4  Manufacturer Part No.: HSMG-C190  Color: GREEN  [LEDC1608X80N_G]  (hidden comment: LED)

### Ports
+3.3V, LED1, LED2

### Nets
+3.3V: LED?#3.2(A) LED?#4.2(A) ; port +3.3V
LED1: LED?#4.1(K) ; port LED1
LED2: LED?#3.1(K) ; port LED2

### Library data of the parts
LED?#3 LED?#4 = LED-Avago-HSMG-C190_Green: as LED?#1 on sheet PowerSupplay; Part Number: LED-Avago-HSMG-C190_Green; ManufacturerPartNumber: LED-Avago-HSMG-C190_Green

## Sheet LCD.SchDoc
size A4

## Nets that join several sheets
+3.3V: MCU_LPC804 (9 pins), PowerSupplay (5 pins), ISO_UART (U?#3.8 U?#4.1), LED (LED?#3.2 LED?#4.2)
+5V: DP_MCP4651 (U?#1.14), PowerSupplay (9 pins)
GND: Top (XP?#1.1 XP?#2.9 XP?#2.10), DP_MCP4651 (U?#1.4), MCU_LPC804 (7 pins), PowerSupplay (22 pins), ISO_UART (U?#3.5 U?#4.4)
+12V: Top (XP?#2.1 XP?#2.2), PowerSupplay (FU?.1)
A0: DP_MCP4651 (U?#1.1), MCU_LPC804 (U?#2.3)
A1: DP_MCP4651 (U?#1.13), MCU_LPC804 (U?#2.4)
A2: DP_MCP4651 (U?#1.12), MCU_LPC804 (U?#2.7)
DEBUG_5V: Top (XP?#1.6), MCU_LPC804 (R?#4.2)
ISO +3.3V: Top (XP?#3.2), ISO_UART (U?#3.1 U?#4.8)
ISO_GND: Top (XP?#3.8), ISO_UART (U?#3.4 U?#4.5)
ISO_RXD: Top (XP?#3.6), ISO_UART (U?#4.6)
ISO_TXD: Top (XP?#3.4), ISO_UART (U?#4.7)
ISP_ENTRY: MCU_LPC804 (U?#2.5), ISO_UART (U?#3.6)
ISP_RESET: MCU_LPC804 (VD?#1.2), ISO_UART (U?#3.7)
LED1: MCU_LPC804 (U?#2.22), LED (LED?#4.1)
LED2: MCU_LPC804 (U?#2.20), LED (LED?#3.1)
RESET: Top (XP?#1.5), MCU_LPC804 (6 pins)
RXD: MCU_LPC804 (U?#2.15), ISO_UART (U?#4.3)
SCL: DP_MCP4651 (U?#1.2), MCU_LPC804 (JP?#1.2 R?#2.1 U?#2.16)
SDA: DP_MCP4651 (U?#1.3), MCU_LPC804 (JP?#2.2 R?#1.1 U?#2.17)
SWCLK: Top (XP?#1.3), MCU_LPC804 (U?#2.8)
SWDIO: Top (XP?#1.2), MCU_LPC804 (U?#2.9)
TXD: MCU_LPC804 (U?#2.10), ISO_UART (U?#4.2)